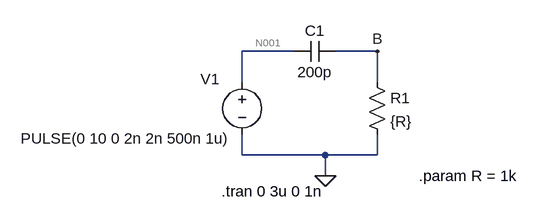
[diagram p0: schematic 3b.asc]
3b.asc, the LTspice schematic file:
Version 4
SHEET 1 880 680
WIRE -32 112 -112 112
WIRE 96 112 32 112
WIRE -112 160 -112 112
WIRE 96 160 96 112
WIRE -112 272 -112 240
WIRE 16 272 -112 272
WIRE 96 272 96 240
WIRE 96 272 16 272
WIRE 16 304 16 272
FLAG 16 304 0
FLAG 96 112 B
SYMBOL voltage -112 144 R0
WINDOW 3 -341 102 Left 2
WINDOW 123 0 0 Left 0
WINDOW 39 0 0 Left 0
WINDOW 0 -64 11 Left 2
SYMATTR Value PULSE(0 10 0 2n 2n 500n 1u)
SYMATTR InstName V1
SYMBOL res 80 144 R0
SYMATTR InstName R1
SYMATTR Value {R}
SYMBOL cap 32 96 R90
WINDOW 0 0 32 VBottom 2
WINDOW 3 32 32 VTop 2
SYMATTR InstName C1
SYMATTR Value 200p
TEXT 160 304 Left 2 !.param R = 1k
TEXT -144 328 Left 2 !.tran 0 3u 0 1n

The netlist it stands for:
* 3b.asc
V1 N001 0 PULSE(0 10 0 2n 2n 500n 1u)
R1 B 0 {R}
C1 B N001 200p
.param R = 1k
.tran 0 3u 0 1n
.backanno
.end

* Results of the author's LTspice run, read from the files saved beside the schematic
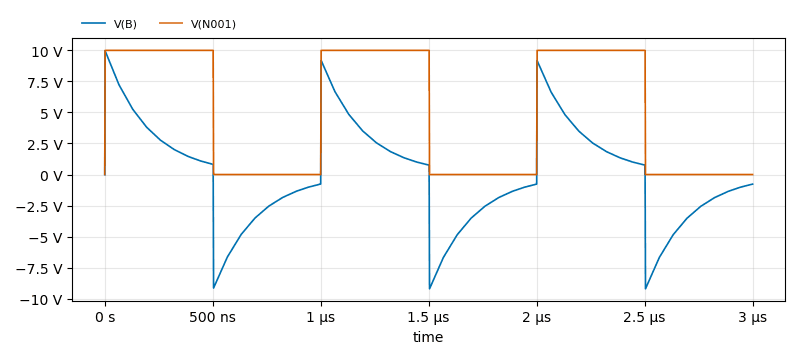
[diagram p1: Transient Analysis of 3b.asc, plotted from the saved traces]
* Transient Analysis, 1 run:
*   V(B): min -9.203 V, max 9.95 V, average 51.85 mV, rms 4.239 V, last -770.7 mV
*   V(N001): min 0 V, max 10 V, average 5.02 V, rms 7.083 V, last 0 V